# Altium schematic sheet I2CTemprature.SchDoc
size A4
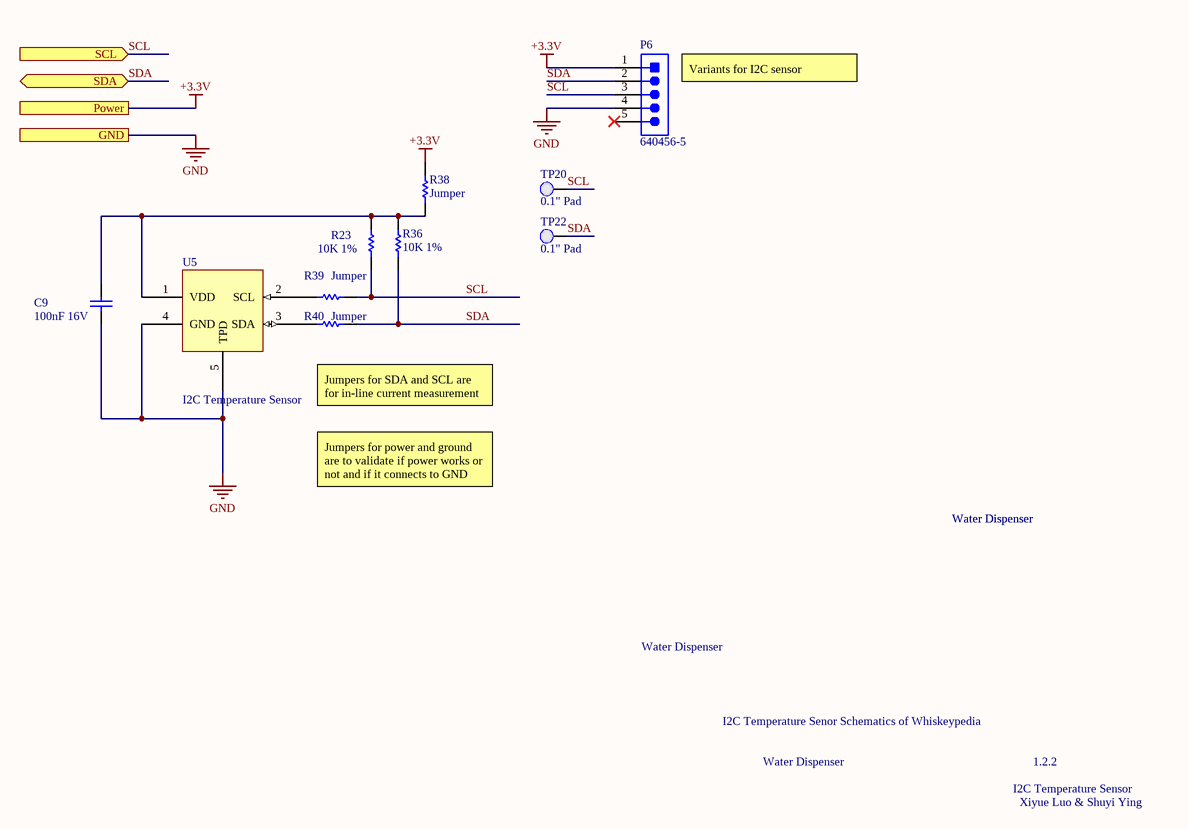
[diagram p0: I2CTemprature.SchDoc]

## Parts
C9  100nF 16V  [CAPC0603(1608)100_N]
P6  640456-5  [TECO-640456-5]
R23  10K 1%  [RESC0603(1608)_N]
R36  10K 1%  [RESC0603(1608)_N]
R38  Jumper  [RESC0805(2012)_N]
R39  Jumper  [RESC0805(2012)_N]
R40  Jumper  [RESC0805(2012)_N]
TP20  0.1" Pad  [PCBComponent]  (no BOM)
TP22  0.1" Pad  [PCBComponent]  (no BOM)
U5  I2C Temperature Sensor  [SHTC3]

## Ports
GND, Power, SCL (in), SDA (bidir)

## Nets
+3.3V: P6.1(DTR) R38.2 ; port Power
GND: C9.1 P6.4(VCC) U5.4(GND) U5.5(TPD) ; port GND
SCL: P6.3(TXO) R23.1 R39.2 TP20.1(PAD) ; port SCL
SDA: P6.2(RXI) R36.1 R40.2 TP22.1(PAD) ; port SDA
NetC9_2: C9.2 R23.2 R36.2 R38.1 U5.1(VDD)
NetR39_1: R39.1 U5.2(SCL)
NetR40_1: R40.1 U5.3(SDA)

Not connected (* = marked no-connect by the designer): P6 5(CTS)*

## Notes on the sheet
- (near P6) Variants for I2C sensor
- Jumpers for SDA and SCL are for in-line current measurement
- Jumpers for power and ground are to validate if power works or not and if it connects to GND
- Water Dispenser
- I2C Temperature Senor Schematics of Whiskeypedia
- I2C Temperature Sensor
- 1.2.2
- Xiyue Luo & Shuyi Ying

## Library data of the parts
C9 = CMP-1035-02584-1: CAP 100nF 16V ±10% 0603 (1608 Metric) Thickness 1mm SMD; Tolerance: Â±10%; Case-EIA: 0603; Case-Metric: 1608; Technology: SMT; Max Thickness: 1 mm; Value: 100nF; Rated Voltage: 16 V
P6 = CMP-1684-00014-1: Male Header, Pitch 2.54 mm, 1 x 5 Position, Height 10.03 mm, Tail Length 3.56 mm, / -55 to 105 degC, RoHS, Bulk; Manufacturer: TE Connectivity; Material, Housing: Polyester; Brand/Series: MTA-100Series; Color, Housing: White; Current, Rating: 5 / A; Temperature, Operating: -55to+105 / °C; Connector Type: MTA-100; Agency Approvals: CSA,UL; Material, Contact: CopperAlloy; Mounting Hole Size: 0.04 / "; Voltage, Rating: 250 / V; Contact Termination Area Plating: Tin; Pin Spacing: 0.1 / "; Primary Type: InterconnectSystem; Special Features: Pinstrip; Mount Angle: Vertical; Contact Centerline Spacing: 0.100 / in.; Number of Contacts: 5; Standards: RoHSCompliant,ELVCompliant,UL94V-0; Angle: Straight; Length, Terminal Post: 0.14 / in.; Manufacturer URL: http://www.te.com; Flammability Rating: UL94V-0; Mounting Type: PCMount; Termination: Solder; Package Reference: THD; Length, Overall: 0.5 / "; Contact Mating Area Plating: Tin; Length, Pin: 0.14 / "; Datasheet URL: http://sigma.octopart.com/77881742/technical_drawing/TE-Connectivity-640456-5.pdf; Package Description: Male Header, Pitch 2.54 mm, 1 x 5 Position, Height 10.03 mm, Tail Length 3.56 mm; Datasheet Version: Rev. W3; Contact Plating: Tin; Color: White; Number of Positions: 5; Type: PCBPlug; Contact Shape: Square; Number of Rows: 1; Size, Post: 0.025 / in.
R23 R36 = CMP-1012-00623-1: 10K 0.1W 1% 0603 (1608 Metric)  SMD; Value: 10000.00 Ohm; Case-EIA: 0603; Case-Metric: 1608; Power: 0.1 W; Tolerance: 1 %; Technology: SMT
R38-R40 = CMP-1013-00001-1: Jumper 0805 (2012 Metric); Case-EIA: 0805; Value: 0.00 Ohm; Tolerance: None; Case-Metric: 2012; Technology: SMT; Power: None
TP20 TP22 = 0.1" Pad-A.4
U5 = SHTC3-TR-2.5KS: Relative Humidity & Temperature Sensor, consumer focus; Manufacturer: Sensirion; Supplier 1: Digi-Key; Supplier Part Number 1: 1649-SHTC3-TR-2.5KSCT-ND; Manufacturer Part Number: SHTC3-TR-2.5KS; RoHS: No; Stock 1: 8766; Pricing 1: 1=3.66000, 5=3.39600, 10=2.82200, 25=2.35120, 50=2.09000, 100=1.98550, 500=1.67200, 1000=1.56750 (USD)